# Altium schematic sheet HydrophoneGroup2FilterAndAmpCircuit.SchDoc
size C
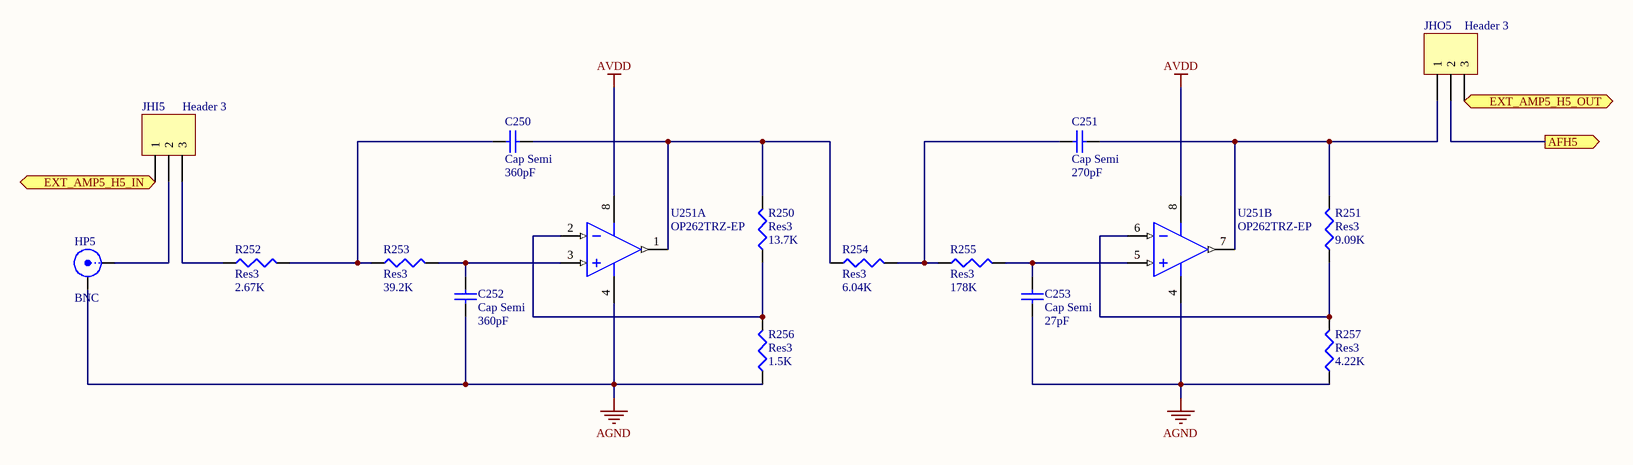
[diagram p0: HydrophoneGroup2FilterAndAmpCircuit.SchDoc]

## Parts
C250  Cap Semi  value 360pF  [1608[0603]]
C251  Cap Semi  value 270pF  [1608[0603]]
C252  Cap Semi  value 360pF  [1608[0603]]
C253  Cap Semi  value 27pF  [1608[0603]]
HP5  BNC  [BNC_RA CON]
JHI5  Header 3  [HDR1X3]
JHO5  Header 3  [HDR1X3]
R250  Res3  value 13.7K  [J1-0603]
R251  Res3  value 9.09K  [J1-0603]
R252  Res3  value 2.67K  [J1-0603]
R253  Res3  value 39.2K  [J1-0603]
R254  Res3  value 6.04K  [J1-0603]
R255  Res3  value 178K  [J1-0603]
R256  Res3  value 1.5K  [J1-0603]
R257  Res3  value 4.22K  [J1-0603]
U251  OP262TRZ-EP  [ADI-R-8_N]  (parts A,B of 2)

## Ports
AFH5 (out), EXT_AMP5_H5_IN, EXT_AMP5_H5_OUT

## Nets
AGND: C252.1 C253.1 HP5.2(Y) R256.1 R257.1 U251.4(-V)
AVDD: U251.8(+V)
AFH5: JHO5.2 ; port AFH5
EXT_AMP5_H5_IN: JHI5.1 ; port EXT_AMP5_H5_IN
EXT_AMP5_H5_OUT: JHO5.3 ; port EXT_AMP5_H5_OUT
NetC250_1: C250.1 R252.2 R253.1
NetC250_2: C250.2 R250.2 R254.1 U251.1(OUT_A)
NetC251_1: C251.1 R254.2 R255.1
NetC251_2: C251.2 JHO5.1 R251.2 U251.7(OUT_B)
NetC252_2: C252.2 R253.2 U251.3(+IN_A)
NetC253_2: C253.2 R255.2 U251.5(+IN_B)
NetHP5_1: HP5.1(X) JHI5.2
NetJHI5_3: JHI5.3 R252.1
NetR250_1: R250.1 R256.2 U251.2(-IN_A)
NetR251_1: R251.1 R257.2 U251.6(-IN_B)

## Library data of the parts
C250-C253 = Cap Semi: Capacitor (Semiconductor SIM Model); Published: 8-Jun-2000; LatestRevisionDate: 29-May-2009; LatestRevisionNote: IPC-7351 Footprint Added.; PackageReference: C1206; Publisher: Altium Limited; PackageDescription: Chip Capacitor
HP5 = BNC: BNC Elbow Connector; LatestRevisionDate: 17-Jul-2002; LatestRevisionNote: Re-released for DXP Platform.; Publisher: Altium Limited
JHI5 JHO5 = Header 3: Header, 3-Pin; LatestRevisionDate: 17-Jul-2002; LatestRevisionNote: Re-released for DXP Platform.; Publisher: Altium Limited
R250-R257 = Res3: Resistor; Published: 8-Jun-2000; LatestRevisionDate: 29-May-2009; LatestRevisionNote: IPC-7351 Footprint Added.; PackageReference: J1-0603; Publisher: Altium Limited; PackageDescription: Chip Resistor
U251 = OP262TRZ-EP: Double Channel Wide Bandwidth Operational Amplifier, 15 MHz BW, 13 V/us SR, Military, 8-pin SOIC (R-8), Tube; Generic Part Number: OP262; Manufacturer: Analog Devices; Amplifiers Per Package: 2; Input Bias Current: 260nA; Input Offset Voltage: 25uV; Iq/Amp: 775uA; Slew Rate: 13V/us; Small Signal Bandwidth: 15MHz; V Span Max: 12V; V Span Min: 2.7V; DatasheetVersion: Rev. G; PackageVersion: 060506-A; PackageReference: R-8; PackageDescription: 8-Pin Standard Small Outline Package, Body 3.9 x 4.9 mm, Pitch 1.27 mm; Supplier 1: Digi-Key; Supplier Part Number 1: OP262TRZ-EP-ND; Supplier 2: Newark; Supplier Part Number 2: 85R9009; Packing: Tube; Mounting Technology: Surface Mount; Code_JEDEC: MS-012-AA; PartNumber: OP262TRZ-EP; ComponentLink1Description: Manufacturer URL; ComponentLink1URL: http://www.analog.com/en/index.html; ComponentLink2Description: Datasheet; ComponentLink2URL: http://www.analog.com/static/imported-files/data_sheets/OP162_262_462.pdf; ComponentLink3Description: Package Specification; ComponentLink3URL: http://www.analog.com/static/imported-files/packages/PKG_PDF/SOIC_Narrow%20(R)/R_8.pdf